# Altium schematic sheet Sheet3.SchDoc
size A4
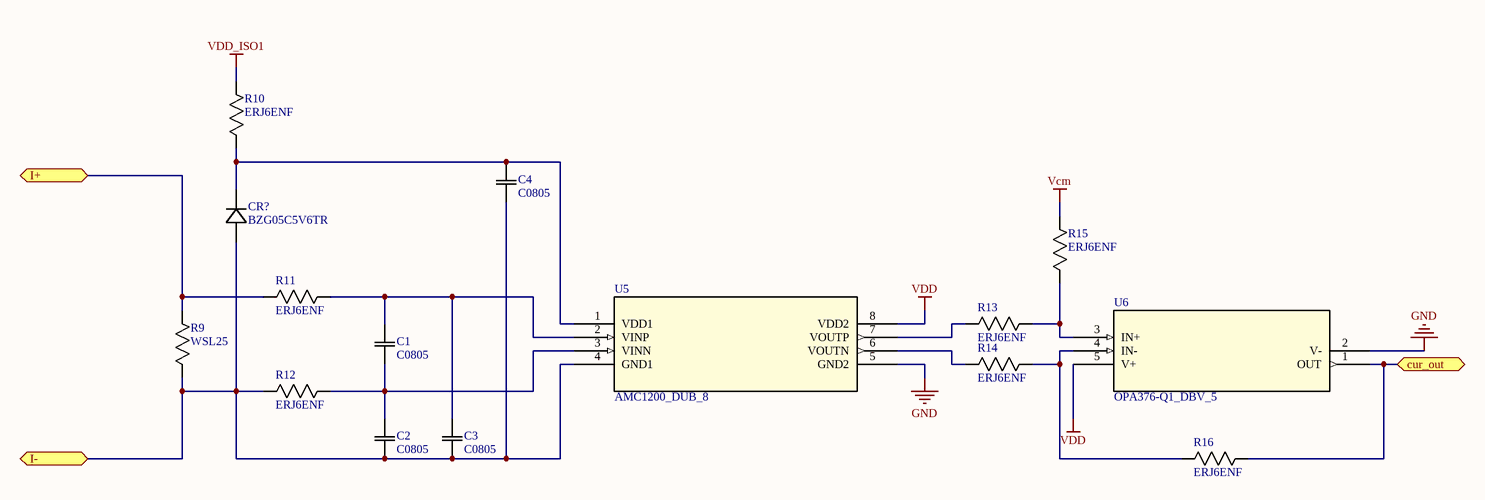
[diagram p0: Sheet3.SchDoc]

## Parts
C1  C0805  [C0805C]
C2  C0805  [C0805C]
C3  C0805  [C0805C]
C4  C0805  [C0805C]
CR?  BZG05C5V6TR  [DO-214AC]
R9  WSL25  [RES_2512_WSL]
R10  ERJ6ENF  [0805]
R11  ERJ6ENF  [0805]
R12  ERJ6ENF  [0805]
R13  ERJ6ENF  [0805]
R14  ERJ6ENF  [0805]
R15  ERJ6ENF  [0805]
R16  ERJ6ENF  [0805]
U5  AMC1200_DUB_8  [DUB8]
U6  OPA376-Q1_DBV_5  [DBV5]

## Ports
cur_out (bidir), I+ (bidir), I- (bidir)

## Nets
GND: U5.5(GND2) U6.2(V-)
Vcm: R15.2
VDD: U5.8(VDD2) U6.5(V+)
VDD_ISO1: R10.2
cur_out: R16.2 U6.1(OUT) ; port cur_out
I+: R9.1 R11.1 ; port I+
I-: C2.1 C3.1 C4.1 CR?.2 R9.2 R12.1 U5.4(GND1) ; port I-
NetC1_1: C1.1 C2.2 R12.2 U5.3(VINN)
NetC1_2: C1.2 C3.2 R11.2 U5.2(VINP)
NetC4_2: C4.2 CR?.1 R10.1 U5.1(VDD1)
NetR13_1: R13.1 U5.7(VOUTP)
NetR13_2: R13.2 R15.1 U6.3(IN+)
NetR14_1: R14.1 U5.6(VOUTN)
NetR14_2: R14.2 R16.1 U6.4(IN-)

## Library data of the parts
C1-C4 = C0805: Imported; Manufacturer_Part_Number: C0805C100C1GACTU; Vendor: Kemet; Built_By: EMA_UL_Team; Type: DEV; C: Copyright (C) 2015 Accelerated Designs. All rights reserved; RefDes: RefDes; Value: Value
CR? = BZG05C5V6TR: Imported; Vendor: Vishay; Built_By: EMA_UL_Team; Type: DEV; C: Copyright (C) 2015 Accelerated Designs. All rights reserved; Manufacturer_Part_Number: BZG05C5V6TR; RefDes: RefDes; Value: Value
R9 = WSL25: Imported; Manufacturer_Part_Number: WSL25121L000FEA; Vendor: Vishay; Built_By: EMA_UL_Team; C: Copyright (C) 2015 Accelerated Designs. All rights reserved; RefDes: RefDes; Type: DEV; Value: Value
R10-R16 = ERJ6ENF: Imported; Manufacturer_Part_Number: ERJ6ENF1000V; Vendor: Panasonic; Built_By: EMA_UL_Team; C: Copyright (C) 2016 Accelerated Designs. All rights reserved; RefDes: RefDes; Type: DEV; Value: Value
U5 = AMC1200_DUB_8: 4kV peak Isolated Amplifier for Current Shunt Measurements; Manufacturer: Texas Instruments; INDUSTRY_STD_PKG_TYPE: SOP; FAMILY_NAME: ISOLATED ADC; PIN_COUNT: 8; PACKAGE_DESIGNATOR: DUB; Datasheet_URL: http://www.ti.com/lit/gpn/AMC1200; GENERIC_PART_NUMBER: AMC1200; RefDes: RefDes; Type: DEV; Value: Value
U6 = OPA376-Q1_DBV_5: Imported; Manufacturer: Texas Instruments; Built_By: EMA_UL_Team; C: Copyright (C) 2015 Accelerated Designs. All rights reserved; Vendor: Texas Instruments; Manufacturer_Part_Number: OPA376-Q1_DBV_5; RefDes: RefDes; Type: DEV; Value: Value